# Altium project praline.PrjPcb (part 3 of 3)

## Sheet fpga.SchDoc
size 431 x 279 mm
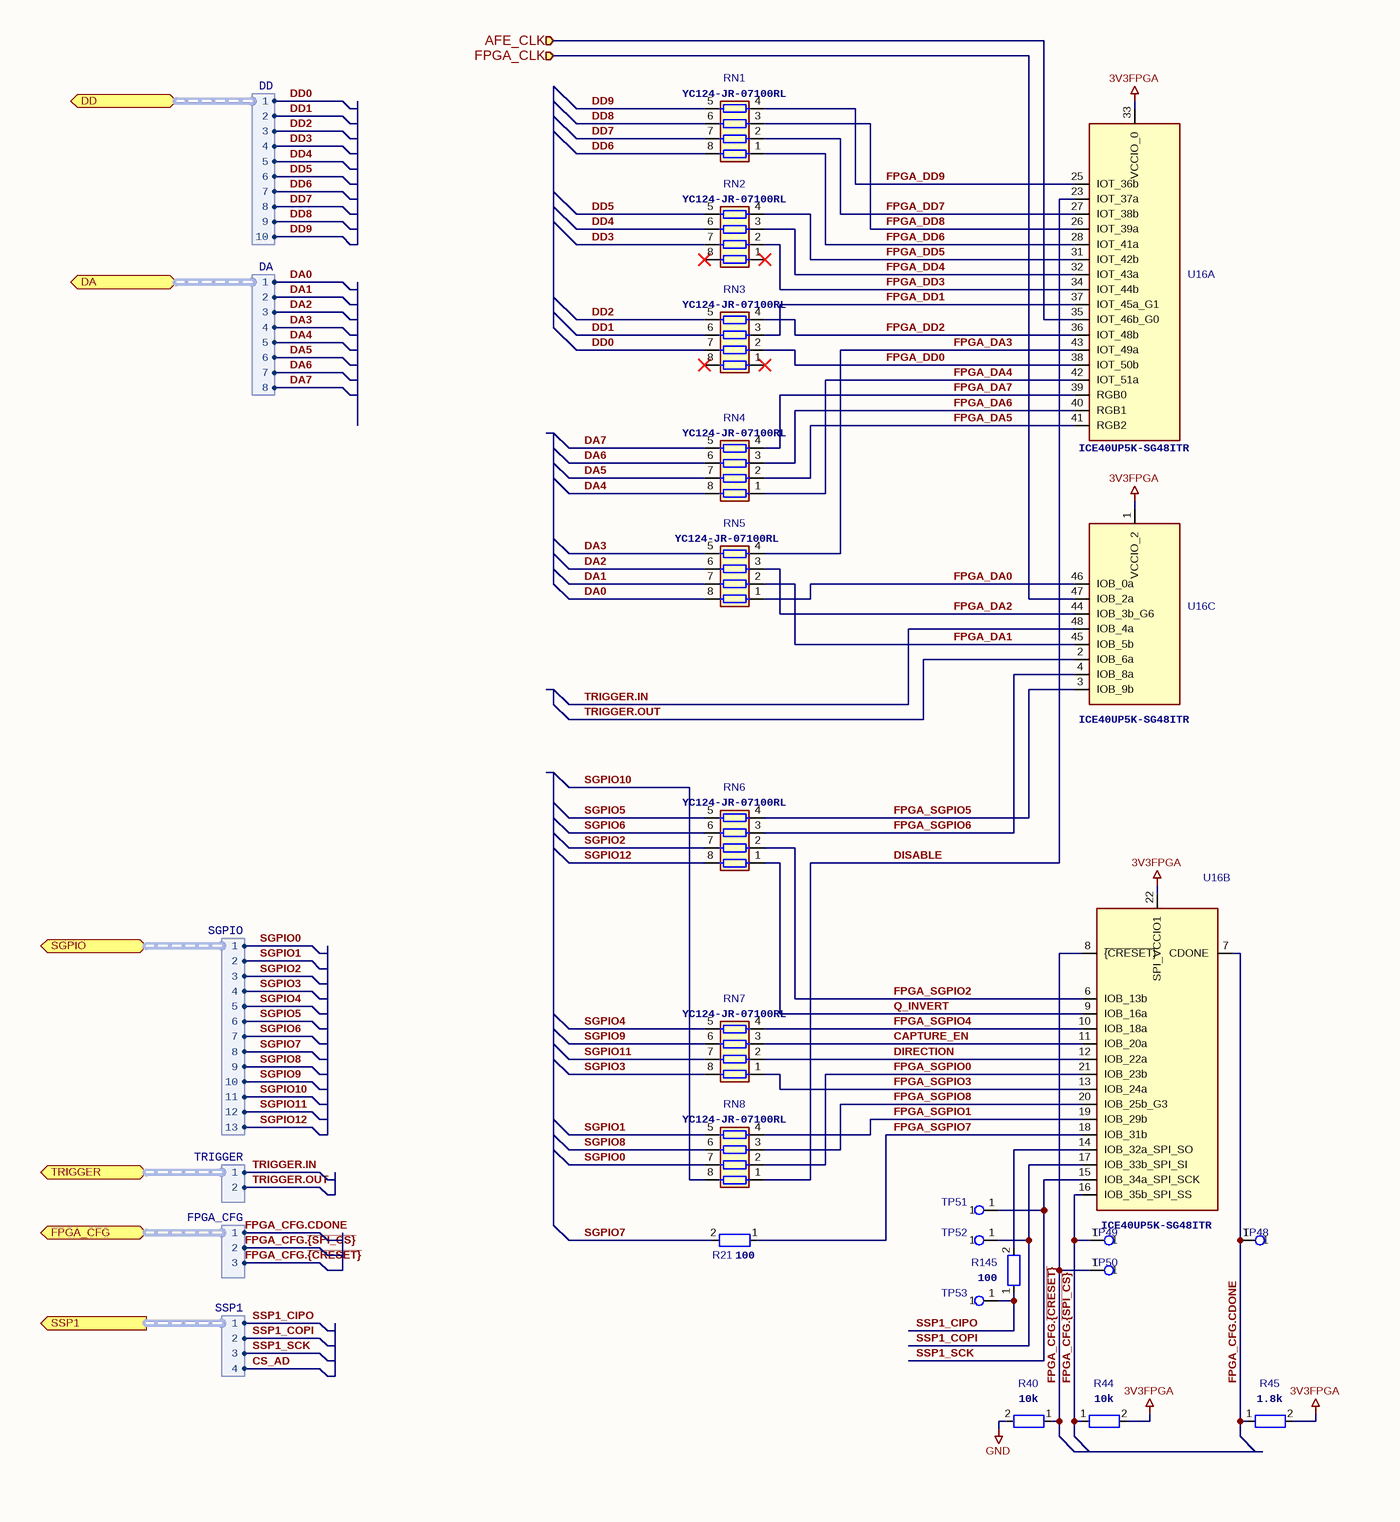
[diagram p11: fpga.SchDoc, left]
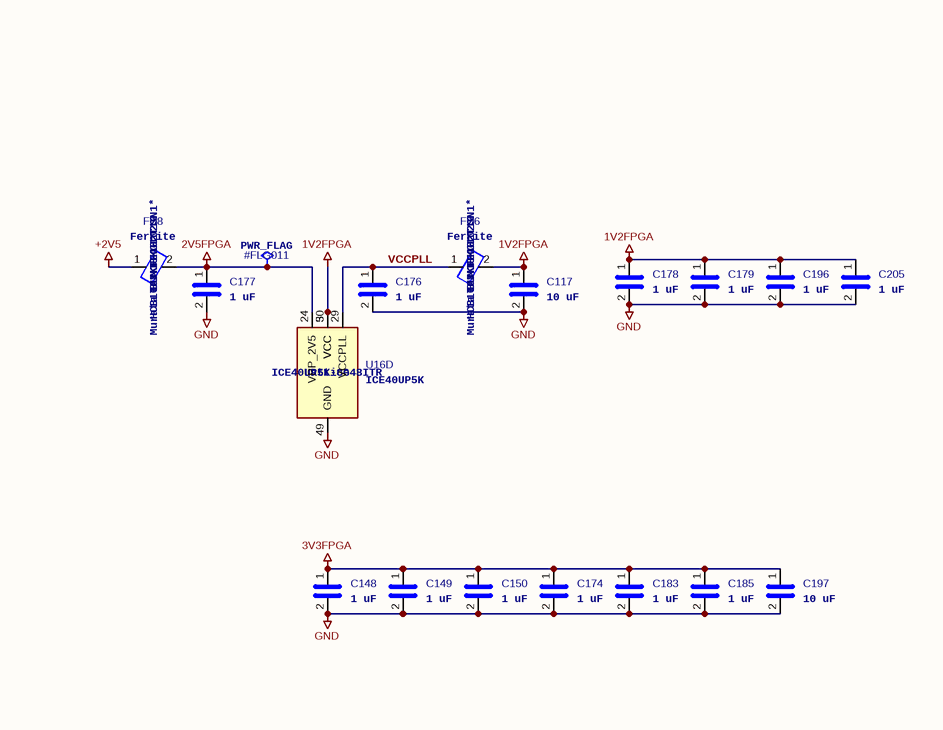
[diagram p12: fpga.SchDoc, right]

### Parts
#FLG011  PWR_FLAG  (graphical)
C117  10 uF  [C_0805_2012Metric]
C148  1 uF  [C_0201_0603Metric]
C149  1 uF  [C_0201_0603Metric]
C150  1 uF  [C_0201_0603Metric]
C174  1 uF  [C_0201_0603Metric]
C176  1 uF  [C_0201_0603Metric]
C177  1 uF  [C_0201_0603Metric]
C178  1 uF  [C_0201_0603Metric]
C179  1 uF  [C_0201_0603Metric]
C183  1 uF  [C_0201_0603Metric]
C185  1 uF  [C_0201_0603Metric]
C196  1 uF  [C_0201_0603Metric]
C197  10 uF  [C_0805_2012Metric]
C205  1 uF  [C_0201_0603Metric]
FB6  Manufacturer: TAI-TECH  Part Number: HCB1608KF-102T10  Substitution: Murata BLM18KG102SN1*  [L_0603_1608Metric]  (hidden comment: Ferrite)
FB8  Manufacturer: TAI-TECH  Part Number: HCB1608KF-102T10  Substitution: Murata BLM18KG102SN1*  [L_0603_1608Metric]  (hidden comment: Ferrite)
R21  100  [R_0201_0603Metric]
R40  10k  [R_0402_1005Metric]
R44  10k  [R_0402_1005Metric]
R45  1.8k  [R_0402_1005Metric]
R145  100  [R_0201_0603Metric]
RN1  Part Number: YC124-JR-07100RL  [R_Array_Convex_4x0402]  (hidden comment: 100)
RN2  Part Number: YC124-JR-07100RL  [R_Array_Convex_4x0402]  (hidden comment: 100)
RN3  Part Number: YC124-JR-07100RL  [R_Array_Convex_4x0402]  (hidden comment: 100)
RN4  Part Number: YC124-JR-07100RL  [R_Array_Convex_4x0402]  (hidden comment: 100)
RN5  Part Number: YC124-JR-07100RL  [R_Array_Convex_4x0402]  (hidden comment: 100)
RN6  Part Number: YC124-JR-07100RL  [R_Array_Convex_4x0402]  (hidden comment: 100)
RN7  Part Number: YC124-JR-07100RL  [R_Array_Convex_4x0402]  (hidden comment: 100)
RN8  Part Number: YC124-JR-07100RL  [R_Array_Convex_4x0402]  (hidden comment: 100)
TP48  TestPoint  [TestPoint_Pad_D1.0mm]  (value not drawn)
TP49  TestPoint  [TestPoint_Pad_D1.0mm]  (value not drawn)
TP50  TestPoint  [TestPoint_Pad_D1.0mm]  (value not drawn)
TP51  TestPoint  [TestPoint_Pad_D1.0mm]  (value not drawn)
TP52  TestPoint  [TestPoint_Pad_D1.0mm]  (value not drawn)
TP53  TestPoint  [TestPoint_Pad_D1.0mm]  (value not drawn)
U16  ICE40UP5K  [QFN-48-1EP_7x7mm_P0.5mm_EP5.6x5.6mm_ThermalVias]  (value not drawn)  (parts A,B,C,D of 4)

### Ports
AFE_CLK (in), DA (bidir, harness DA), DD (bidir, harness DD), FPGA_CFG (bidir, harness FPGA_CFG), FPGA_CLK (in), SGPIO (bidir, harness SGPIO), SSP1 (out, harness SSP1), TRIGGER (bidir, harness TRIGGER)

### Harnesses
TRIGGER: 1, 2
FPGA_CFG: 1, 2, 3
SSP1: 1, 2, 3, 4
SGPIO: 1, 5, 4, 3, 2, 13, 7, 8, 11, 9, 12, 10, 6
DD: 1, 5, 4, 3, 2, 7, 8, 9, 6, 10
DA: 1, 5, 4, 3, 2, 7, 8, 6

### Nets
1V2FPGA: C117.1 C178.1 C179.1 C196.1 C205.1 FB6.2 U16.5(VCC) U16.30(VCC)
2V5FPGA: #FLG011.1 C177.1 FB8.2 U16.24(VPP_2V5)
3V3FPGA: C148.1 C149.1 C150.1 C174.1 C183.1 C185.1 C197.1 R44.2 R45.2 U16.1(VCCIO_2) U16.22(SPI_VCCIO1) U16.33(VCCIO_0)
+2V5: FB8.1
GND: C117.2 C148.2 C149.2 C150.2 C174.2 C176.2 C177.2 C178.2 C179.2 C183.2 C185.2 C196.2 C197.2 C205.2 R40.2 U16.49(GND)
AFE_CLK: U16.35(IOT_46b_G0) ; port AFE_CLK
CAPTURE_EN: RN7.3(R3.1) U16.11(IOB_20a)
DA0: RN5.8(R1.2) ; port DA.1
DA1: RN5.7(R2.2) ; port DA.2
DA2: RN5.6(R3.2) ; port DA.3
DA3: RN5.5(R4.2) ; port DA.4
DA4: RN4.8(R1.2) ; port DA.5
DA5: RN4.7(R2.2) ; port DA.6
DA6: RN4.6(R3.2) ; port DA.7
DA7: RN4.5(R4.2) ; port DA.8
DD0: RN3.7(R2.2) ; port DD.1
DD1: RN3.6(R3.2) ; port DD.2
DD2: RN3.5(R4.2) ; port DD.3
DD3: RN2.7(R2.2) ; port DD.4
DD4: RN2.6(R3.2) ; port DD.5
DD5: RN2.5(R4.2) ; port DD.6
DD6: RN1.8(R1.2) ; port DD.7
DD7: RN1.7(R2.2) ; port DD.8
DD8: RN1.6(R3.2) ; port DD.9
DD9: RN1.5(R4.2) ; port DD.10
DIRECTION: RN7.2(R2.1) U16.12(IOB_22a)
DISABLE: RN8.1(R1.1) U16.23(IOT_37a)
FPGA_CFG.CDONE: R45.1 TP48.1 U16.7(CDONE) ; port FPGA_CFG.1
FPGA_CFG.~{{CRESET}}: R40.1 TP50.1 U16.8(~{{CRESET}}) ; port FPGA_CFG.3
FPGA_CFG.~{{SPI_CS}}: R44.1 TP49.1 U16.16(IOB_35b_SPI_SS) ; port FPGA_CFG.2
FPGA_CLK: U16.47(IOB_2a) ; port FPGA_CLK
FPGA_DA0: RN5.1(R1.1) U16.46(IOB_0a)
FPGA_DA1: RN5.2(R2.1) U16.45(IOB_5b)
FPGA_DA2: RN5.3(R3.1) U16.44(IOB_3b_G6)
FPGA_DA3: RN5.4(R4.1) U16.43(IOT_49a)
FPGA_DA4: RN4.1(R1.1) U16.42(IOT_51a)
FPGA_DA5: RN4.2(R2.1) U16.41(RGB2)
FPGA_DA6: RN4.3(R3.1) U16.40(RGB1)
FPGA_DA7: RN4.4(R4.1) U16.39(RGB0)
FPGA_DD0: RN3.2(R2.1) U16.38(IOT_50b)
FPGA_DD1: RN3.3(R3.1) U16.37(IOT_45a_G1)
FPGA_DD2: RN3.4(R4.1) U16.36(IOT_48b)
FPGA_DD3: RN2.2(R2.1) U16.34(IOT_44b)
FPGA_DD4: RN2.3(R3.1) U16.32(IOT_43a)
FPGA_DD5: RN2.4(R4.1) U16.31(IOT_42b)
FPGA_DD6: RN1.1(R1.1) U16.28(IOT_41a)
FPGA_DD7: RN1.2(R2.1) U16.27(IOT_38b)
FPGA_DD8: RN1.3(R3.1) U16.26(IOT_39a)
FPGA_DD9: RN1.4(R4.1) U16.25(IOT_36b)
FPGA_SGPIO0: RN8.2(R2.1) U16.21(IOB_23b)
FPGA_SGPIO1: RN8.4(R4.1) U16.19(IOB_29b)
FPGA_SGPIO2: RN6.2(R2.1) U16.6(IOB_13b)
FPGA_SGPIO3: RN7.1(R1.1) U16.13(IOB_24a)
FPGA_SGPIO4: RN7.4(R4.1) U16.10(IOB_18a)
FPGA_SGPIO5: RN6.4(R4.1) U16.3(IOB_9b)
FPGA_SGPIO6: RN6.3(R3.1) U16.4(IOB_8a)
FPGA_SGPIO7: R21.1 U16.18(IOB_31b)
FPGA_SGPIO8: RN8.3(R3.1) U16.20(IOB_25b_G3)
Q_INVERT: RN6.1(R1.1) U16.9(IOB_16a)
SGPIO0: RN8.7(R2.2) ; port SGPIO.1
SGPIO1: RN8.5(R4.2) ; port SGPIO.2
SGPIO2: RN6.7(R2.2) ; port SGPIO.3
SGPIO3: RN7.8(R1.2) ; port SGPIO.4
SGPIO4: RN7.5(R4.2) ; port SGPIO.5
SGPIO5: RN6.5(R4.2) ; port SGPIO.6
SGPIO6: RN6.6(R3.2) ; port SGPIO.7
SGPIO7: R21.2 ; port SGPIO.8
SGPIO8: RN8.6(R3.2) ; port SGPIO.9
SGPIO9: RN7.6(R3.2) ; port SGPIO.10
SGPIO10: RN8.8(R1.2) ; port SGPIO.11
SGPIO11: RN7.7(R2.2) ; port SGPIO.12
SGPIO12: RN6.8(R1.2) ; port SGPIO.13
SSP1_CIPO: R145.1 TP53.1 ; port SSP1.1
SSP1_COPI: TP52.1 U16.17(IOB_33b_SPI_SI) ; port SSP1.2
SSP1_SCK: TP51.1 U16.15(IOB_34a_SPI_SCK) ; port SSP1.3
TRIGGER.IN: U16.48(IOB_4a) ; port TRIGGER.1
TRIGGER.OUT: U16.2(IOB_6a) ; port TRIGGER.2
VCCPLL: C176.1 FB6.1 U16.29(VCCPLL)
NetR145_2: R145.2 U16.14(IOB_32a_SPI_SO)

Not connected (* = marked no-connect by the designer): RN2 1(R1.1)* 8(R1.2)*; RN3 1(R1.1)* 8(R1.2)*

### Notes on the sheet
- 1
- 2
- 3
- 4
- 5
- 6
- 7
- 8
- A
- B
- C
- D
- E
- ${LICENSE}
- Title: ${TITLE}
- File: fpga.kicad_sch
- Sheet: /
- ${COPYRIGHT}
- KiCad E.D.A.  kicad (5.1.4)-1
- Size: USLedger
- Date: ${DATE}
- Rev: ${VERSION}
- Id: 1/1

### Library data of the parts
C117 = C: Part Number: CL21A106KOQNNNE; Manufacturer: Samsung; Substitution: Murata GRM155R61E105KA12D; Value: 10 uF; Footprint: Capacitor_SMD:C_0805_2012Metric
C148-C150 C174 C176-C179 C183 C185 C196 C205 = C: Part Number: GRM033R61A105ME44D; Manufacturer: Murata; Substitution: GRM033R61A105ME44*, GRM033R61C105ME15*, Samsung CL03A105MO3NRN*; Value: 1 uF; Footprint: Capacitor_SMD:C_0201_0603Metric
C197 = C: Manufacturer: Samsung; Part Number: CL21A106KOQNNNE; Substitution: Murata GRM21BR61A106KE19L; Value: 10 uF; Footprint: Capacitor_SMD:C_0805_2012Metric
FB6 FB8 = FerriteBead: Value: Ferrite; Footprint: Inductor_SMD:L_0603_1608Metric
R21 R145 = R: Manufacturer: Yageo; Part Number: RC0201JR-07100RL; Substitution: any equivalent; Value: 100; Footprint: Resistor_SMD:R_0201_0603Metric
R40 R44 = R: Manufacturer: Yageo; Part Number: RC0402JR-0710KL; Substitution: any equivalent; Value: 10k; Footprint: Resistor_SMD:R_0402_1005Metric
R45 = R: Manufacturer: Yageo; Part Number: RC0402JR-071K8L; Substitution: any equivalent; Value: 1.8k; Footprint: Resistor_SMD:R_0402_1005Metric
RN1-RN8 = R_Pack04: Manufacturer: Yageo; Substitution: any equivalent; Value: 100; Footprint: Resistor_SMD:R_Array_Convex_4x0402
U16 = ICE40UP5K-SG48ITR: Manufacturer: Lattice; Part Number: ICE40UP5K-SG48ITR; Value: ICE40UP5K; Footprint: praline:QFN-48-1EP_7x7mm_P0.5mm_EP5.6x5.6mm_ThermalVias
#FLG011 = PWR_FLAG: Value: PWR_FLAG
TP48-TP53 = TestPoint: Value: TestPoint; Footprint: TestPoint:TestPoint_Pad_D1.0mm

## Sheet image_reject.SchDoc
size 297 x 209 mm
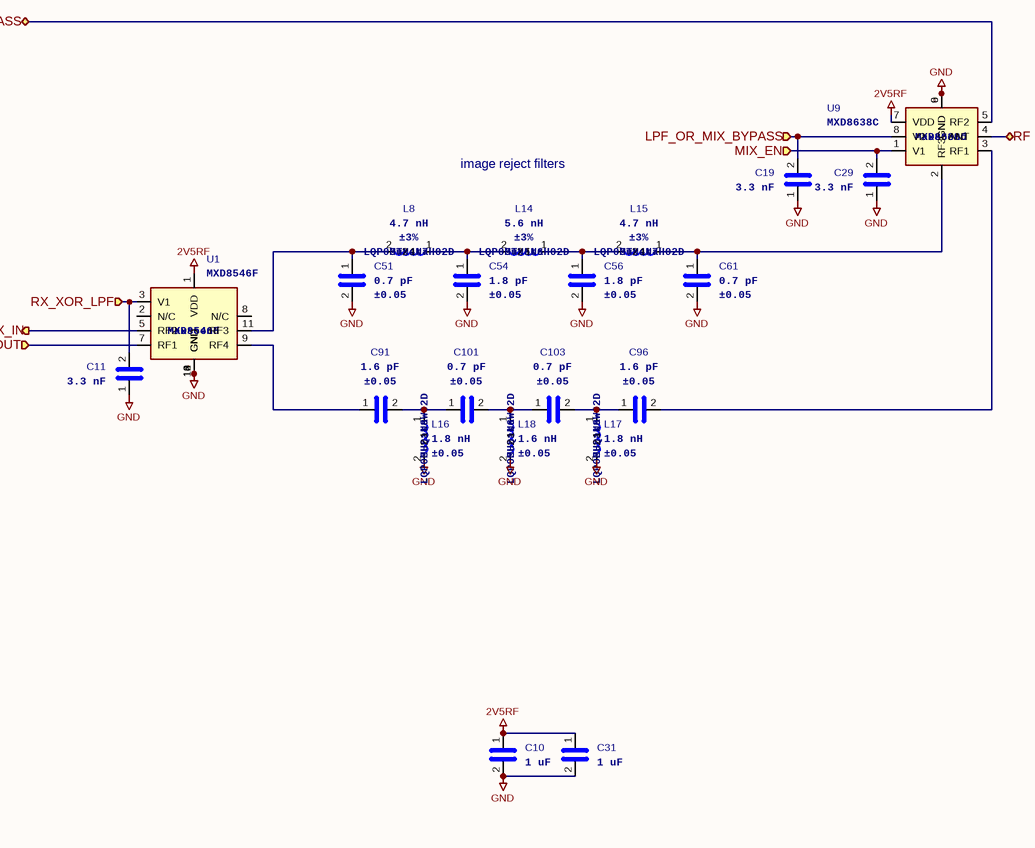
[diagram p13: image_reject.SchDoc]

### Parts
C10  1 uF  [C_0201_0603Metric]
C11  3.3 nF  [C_0201_0603Metric]
C19  3.3 nF  [C_0201_0603Metric]
C29  3.3 nF  [C_0201_0603Metric]
C31  1 uF  [C_0201_0603Metric]
C51  Tolerance: ±0.05  [C_0201_0603Metric]  (hidden comment: 0.7 pF)
C54  Tolerance: ±0.05  [C_0201_0603Metric]  (hidden comment: 1.8 pF)
C56  Tolerance: ±0.05  [C_0201_0603Metric]  (hidden comment: 1.8 pF)
C61  Tolerance: ±0.05  [C_0201_0603Metric]  (hidden comment: 0.7 pF)
C91  Tolerance: ±0.05  [C_0201_0603Metric]  (hidden comment: 1.6 pF)
C96  Tolerance: ±0.05  [C_0201_0603Metric]  (hidden comment: 1.6 pF)
C101  Tolerance: ±0.05  [C_0201_0603Metric]  (hidden comment: 0.7 pF)
C103  Tolerance: ±0.05  [C_0201_0603Metric]  (hidden comment: 0.7 pF)
L8  Manufacturer: Murata  Part Number: LQP03TN4N7H02D  Tolerance: ±3%  [L_0201_0603Metric]  (hidden comment: 4.7 nH)
L14  Manufacturer: Murata  Part Number: LQP03TN5N6H02D  Tolerance: ±3%  [L_0201_0603Metric]  (hidden comment: 5.6 nH)
L15  Manufacturer: Murata  Part Number: LQP03TN4N7H02D  Tolerance: ±3%  [L_0201_0603Metric]  (hidden comment: 4.7 nH)
L16  Manufacturer: Murata  Part Number: LQP03HQ1N8W02D  Tolerance: ±0.05  [L_0201_0603Metric]  (hidden comment: 1.8 nH)
L17  Manufacturer: Murata  Part Number: LQP03HQ1N8W02D  Tolerance: ±0.05  [L_0201_0603Metric]  (hidden comment: 1.8 nH)
L18  Manufacturer: Murata  Part Number: LQP03HQ1N6W02D  Tolerance: ±0.05  [L_0201_0603Metric]  (hidden comment: 1.6 nH)
U1  Manufacturer: Maxscend  [QFN-12-1EP_2x2mm_P0.5mm_EP1x1mm]  (hidden comment: MXD8546F)
U9  Manufacturer: Maxscend  [MXD8638C]  (hidden comment: MXD8638C)

### Ports
LPF_OR_MIX_BYPASS (in), MIX_BYPASS (bidir), MIX_EN (in), RF (bidir), RX_MIX_IN (out), RX_XOR_LPF (in), TX_MIX_OUT (in)

### Nets
2V5RF: C10.1 C31.1 U1.1(VDD) U9.7(VDD)
GND: C10.2 C11.1 C19.1 C29.1 C31.2 C51.2 C54.2 C56.2 C61.2 L16.2 L17.2 L18.2 U1.4(GND) U1.6(GND) U1.10(GND) U1.12(GND) U1.13(GND) U9.6(GND) U9.9(GND)
LPF_OR_MIX_BYPASS: C19.2 U9.8(V2) ; port LPF_OR_MIX_BYPASS
MIX_BYPASS: U9.5(RF2) ; port MIX_BYPASS
MIX_EN: C29.2 U9.1(V1) ; port MIX_EN
RF: U9.4(ANT) ; port RF
RX_MIX_IN: U1.5(RF2) ; port RX_MIX_IN
RX_XOR_LPF: C11.2 U1.3(V1) ; port RX_XOR_LPF
TX_MIX_OUT: U1.7(RF1) ; port TX_MIX_OUT
NetC51_1: C51.1 L8.2 U1.11(RF3)
NetC54_1: C54.1 L8.1 L14.2
NetC56_1: C56.1 L14.1 L15.2
NetC61_1: C61.1 L15.1 U9.2(RF3)
NetC91_1: C91.1 U1.9(RF4)
NetC91_2: C91.2 C101.1 L16.1
NetC96_1: C96.1 C103.2 L17.1
NetC96_2: C96.2 U9.3(RF1)
NetC101_2: C101.2 C103.1 L18.1

Not connected (* = marked no-connect by the designer): U1 2(N/C) 8(N/C)

### Notes on the sheet
- image reject filters
- 1
- 2
- 3
- 4
- 5
- 6
- A
- B
- C
- ${LICENSE}
- D
- Title: ${TITLE}
- File: image_reject.kicad_sch
- Sheet: /
- ${COPYRIGHT}
- KiCad E.D.A.  kicad (5.1.4)-1
- Size: A4
- Date: ${DATE}
- Rev: ${VERSION}
- Id: 1/1

### Library data of the parts
C10 C31 = C: Manufacturer: Murata; Part Number: GRM033R61A105ME44D; Substitution: GRM033R61A105ME44*, GRM033R61C105ME15*, Samsung CL03A105MO3NRN*; Value: 1 uF; Footprint: Capacitor_SMD:C_0201_0603Metric
C11 C19 C29 = C: Manufacturer: Murata; Part Number: GRM033R71A332KA01D; Substitution: GRM033R71A332K*; Value: 3.3 nF; Footprint: Capacitor_SMD:C_0201_0603Metric
C51 C61 C101 C103 = C: Manufacturer: Murata; Part Number: GRM0335C1ER70WA01D; Substitution: GRM0335C1HR70W*, GRM0335C1ER70W*; Value: 0.7 pF; Footprint: Capacitor_SMD:C_0201_0603Metric
C54 C56 = C: Manufacturer: Murata; Part Number: GRM0335C1E1R8WA01D; Substitution: GRM0335C1H1R8W*, GRM0335C1E1R8W*; Value: 1.8 pF; Footprint: Capacitor_SMD:C_0201_0603Metric
C91 C96 = C: Manufacturer: Murata; Part Number: GRM0335C1E1R6WA01D; Substitution: GRM0335C1H1R6W*, GRM0335C1E1R6W*; Value: 1.6 pF; Footprint: Capacitor_SMD:C_0201_0603Metric
L8 L14-L18 = L: Footprint: Inductor_SMD:L_0201_0603Metric
  L8 L15: Value: 4.7 nH
  L14: Value: 5.6 nH
  L16 L17: Value: 1.8 nH
  L18: Value: 1.6 nH
U9 = MXD8638: Part Number: MXD8638C; Value: MXD8638C; Footprint: praline:MXD8638C
U1 = MXD8546F: Part Number: MXD8546F; Value: MXD8546F; Footprint: praline:QFN-12-1EP_2x2mm_P0.5mm_EP1x1mm

## Nets that join several sheets
1V2FPGA: power (C184.1 FB7.2 TP22.1), fpga (8 pins)
2V5RF: baseband (C17.1 C21.1 U2.1 U7.4), frontend (6 pins), power (C23.1 TP3.1 U32.2), mixer (C7.1 C8.1 U5.4 U6.4), switch_control (10 pins), image_reject (C10.1 C31.1 U1.1 U9.7)
3V3AUX: mcu (P20.3 P22.11 P28.1), power (C32.1 TP17.1 U28.6)
3V3CLK: power (C167.1 FB2.2 TP16.1), clock (16 pins)
3V3FPGA: mcu (C140.1 R76.2), adc-dac (C123.1 C186.1 C187.1 U18.18), power (9 pins), fpga (12 pins)
3V3LED: mcu (12 pins), power (6 pins)
+2V5: power (C175.1 TP1.1 U22.2), fpga (FB8.1)
GND: praline (9 pins), mcu (59 pins), baseband (39 pins), frontend (43 pins), adc-dac (36 pins), power (46 pins), usb (12 pins), mixer (34 pins), clock (23 pins), switch_control (14 pins), fpga (16 pins), image_reject (19 pins)
VAA: mcu (C162.1 R18.2), baseband (22 pins), frontend (20 pins), adc-dac (24 pins), power (7 pins), mixer (18 pins), switch_control (C212.1 U39.5)
VCC: mcu (29 pins), power (14 pins), clock (8 pins)
1V2_EN: mcu (U23.J1), power (R54.2 U21.9)
!VAA_ENABLE: mcu (U23.G4), power (R60.2)
AA_EN: mcu (U23.K7), adc-dac (TP55.1 U8.10 U34.10 U36.2)
ADC0_4: mcu (U23.A5), usb (R106.1 R157.1)
ADC0_7: mcu (U23.B5), usb (R103.1 R156.1)
AFE_CLK: adc-dac (U18.6), clock (R31.1 TP29.1), fpga (U16.35)
AUX_CLK2: mcu (P22.25), clock (R34.1 U33.4)
CLKIN_CTRL: mcu (U23.J10), clock (U37.6)
CS_AD: mcu (U23.P12), adc-dac (U18.36)
DA0: adc-dac (U18.13), fpga (RN5.8)
DA1: adc-dac (U18.14), fpga (RN5.7)
DA2: adc-dac (U18.15), fpga (RN5.6)
DA3: adc-dac (U18.16), fpga (RN5.5)
DA4: adc-dac (U18.19), fpga (RN4.8)
DA5: adc-dac (U18.20), fpga (RN4.7)
DA6: adc-dac (U18.21), fpga (RN4.6)
DA7: adc-dac (U18.22), fpga (RN4.5)
DD0: adc-dac (U18.23), fpga (RN3.7)
DD1: adc-dac (U18.24), fpga (RN3.6)
DD2: adc-dac (U18.25), fpga (RN3.5)
DD3: adc-dac (U18.26), fpga (RN2.7)
DD4: adc-dac (U18.27), fpga (RN2.6)
DD5: adc-dac (U18.28), fpga (RN2.5)
DD6: adc-dac (U18.29), fpga (RN1.8)
DD7: adc-dac (U18.30), fpga (RN1.7)
DD8: adc-dac (U18.31), fpga (RN1.6)
DD9: adc-dac (U18.32), fpga (RN1.5)
FPGA_CFG.CDONE: mcu (U23.L3), fpga (R45.1 TP48.1 U16.7)
FPGA_CFG.~{{CRESET}}: mcu (U23.M3), fpga (R40.1 TP50.1 U16.8)
FPGA_CFG.~{{SPI_CS}}: mcu (U23.M1), fpga (R44.1 TP49.1 U16.16)
FPGA_CLK: clock (R12.1 TP65.1), fpga (U16.47)
LPF_EN: mcu (U23.H12), switch_control (R98.1 TP45.1)
LPF_OR_MIX_BYPASS: switch_control (TP40.1 U27.4), image_reject (C19.2 U9.8)
MCU_CLK: mcu (U23.F4), clock (R139.1 TP36.1)
MIX_BYPASS: baseband (FL2.3), image_reject (U9.5)
MIX_CLK: mixer (R150.2 R151.1), clock (R23.1 TP34.1)
MIX_EN: switch_control (TP37.1 U10.2 U26.6 U39.1), image_reject (C29.2 U9.1)
MIXER.ENBL: mcu (U23.P1), mixer (C109.1 U4.1)
MIXER.LD: mcu (U23.M7), mixer (U4.26)
MIXER.SCLK: mcu (U23.L7), mixer (C36.1 U4.31)
MIXER.SDATA: mcu (U23.M6), mixer (C37.1 U4.32)
MIXER.~{{EN}}: mcu (U23.N7), mixer (C35.1 U4.30)
MIXER.~{{RESET}}: mcu (U23.N8), mixer (C34.1 R5.2 U4.29)
MODE: mcu (U23.J2), power (R51.1 U21.2)
P1_CTRL0: mcu (U23.F14), clock (U33.11)
P1_CTRL1: mcu (U23.F12), clock (U33.10)
P1_CTRL2: mcu (U23.H13), clock (U33.9)
P2: mcu (P22.1), clock (D9.1 P2.1 R108.1)
P2_5: mcu (U23.J12), clock (U33.5)
P2_CTRL0: mcu (U23.K10), clock (U30.6)
P2_CTRL1: mcu (U23.J11), clock (U31.6)
P22_CLKIN: mcu (P22.2), clock (U33.1 U37.1)
RF: frontend (U12.4), image_reject (U9.4)
RF_AMP_EN: mcu (U23.J13), switch_control (R96.1 TP46.1)
RX_EN: baseband (C20.2 U7.6), frontend (Q1.2 Q1.5), mixer (C9.2 C16.2 U5.6 U6.6), switch_control (5 pins)
RX_MIX_IN: mixer (U6.1), image_reject (U1.5)
RX_MIX_OUT: baseband (U7.1), mixer (U5.1)
RX_XOR_LPF: switch_control (TP38.1 U11.4), image_reject (C11.2 U1.3)
RX_XOR_MIX: baseband (C18.2 U2.3), switch_control (TP39.1 U10.4)
RXBB.I+: baseband (U17.38), adc-dac (TP62.1 U35.1)
RXBB.I-: baseband (U17.37), adc-dac (TP63.1 U35.2)
RXBB.Q+: baseband (U17.36), adc-dac (TP60.1 U3.1)
RXBB.Q-: baseband (U17.35), adc-dac (TP61.1 U3.2)
SCL: mcu (P22.26 U23.K13), clock (R28.2 U19.4)
SCT_CLK: mcu (U23.M14), clock (R41.1 TP32.1)
SDA: mcu (P22.24 U23.K14), clock (R27.2 U19.5)
SGPIO0: mcu (U23.K3), fpga (RN8.7)
SGPIO1: mcu (U23.K2), fpga (RN8.5)
SGPIO2: mcu (U23.P11), fpga (RN6.7)
SGPIO3: mcu (U23.L5), fpga (RN7.8)
SGPIO4: mcu (U23.M8), fpga (RN7.5)
SGPIO5: mcu (U23.K12), fpga (RN6.5)
SGPIO6: mcu (U23.L13), fpga (RN6.6)
SGPIO7: mcu (U23.L1), fpga (R21.2)
SGPIO8: mcu (U23.E4), fpga (RN8.6)
SGPIO9: mcu (U23.P5), fpga (RN7.6)
SGPIO10: mcu (U23.J4), fpga (RN8.8)
SGPIO11: mcu (U23.L6), fpga (RN7.7)
SGPIO12: mcu (U23.N10), fpga (RN6.8)
SSP1_CIPO: mcu (U23.M2), fpga (R145.1 TP53.1)
SSP1_COPI: mcu (R140.2), baseband (U17.19), adc-dac (U18.34), fpga (TP52.1 U16.17)
SSP1_SCK: mcu (R141.2), baseband (U17.18), adc-dac (U18.35), fpga (TP51.1 U16.15)
TRIGGER.IN: mcu (P28.16 R127.1), clock (U30.3 U33.13), fpga (U16.48)
TRIGGER.OUT: mcu (P28.15 R6.2), clock (U30.1 U33.12), fpga (U16.2)
TX_EN: mcu (U23.L14), switch_control (R24.1 TP43.1 U39.2)
TX_MIX_EN: mixer (U38.5), switch_control (TP66.1 U39.4)
TX_MIX_IN: baseband (U7.3), mixer (U6.3)
TX_MIX_OUT: mixer (C189.1), image_reject (U1.7)
TXBB.I+: baseband (U17.45), adc-dac (R8.2 R17.1 R119.2 TP57.1)
TXBB.I-: baseband (U17.44), adc-dac (R9.2 R16.1 R119.1 TP56.1)
TXBB.Q+: baseband (U17.43), adc-dac (R10.2 R15.1 R118.2 TP58.1)
TXBB.Q-: baseband (U17.42), adc-dac (R13.2 R14.1 R118.1 TP59.1)
USB_DATA.D+: mcu (U23.E2), usb (FL1.3)
USB_DATA.D-: mcu (U23.F2), usb (FL1.1)
VBUS: mcu (P20.21), power (5 pins), usb (5 pins)
VBUS_SAFE: mcu (R62.2), power (D12.2 Q4.3)
VIN: mcu (P20.22), power (5 pins)
XCVR.LD: mcu (U23.M9), baseband (U17.22)
XCVR.RSSI: mcu (U23.C4), baseband (U17.16)
XCVR.RXHP: mcu (U23.P13), baseband (U17.40)
XCVR.RXTX: mcu (U23.L12), baseband (U17.48)
XCVR.~{{CS}}: mcu (U23.L11), baseband (U17.15)
XCVR.~{{SHDN}}: mcu (U23.M12), baseband (R109.1 U17.12)
XCVR_CLK: baseband (R148.1 R149.2), clock (R32.1 TP33.1)
~{{3V3AUX_EN}}: mcu (U23.H11), power (R100.1 U28.3)
~{{3V3AUX_OC}}: mcu (U23.F11), power (U28.4)
~{{BIAS_EN}}: mcu (U23.D13), frontend (R36.1 U24.3)
~{{BIAS_OC}}: mcu (U23.E13), frontend (U24.4)
~{{MIX_EN}}: mcu (U23.N13), switch_control (R94.1 TP44.1)
~{{RX_AMP_EN}}: frontend (6 pins), switch_control (TP41.1 U26.8)
~{{TX_AMP_EN}}: frontend (6 pins), switch_control (TP42.1 U26.11)
~{{VBUS_IN_EN}}: mcu (U23.H2), power (R77.2)
~{{VIN_IN_EN}}: mcu (U23.H1), power (R78.2)